# Altium schematic sheet TP_IHM_7SEG.SchDoc
size A4
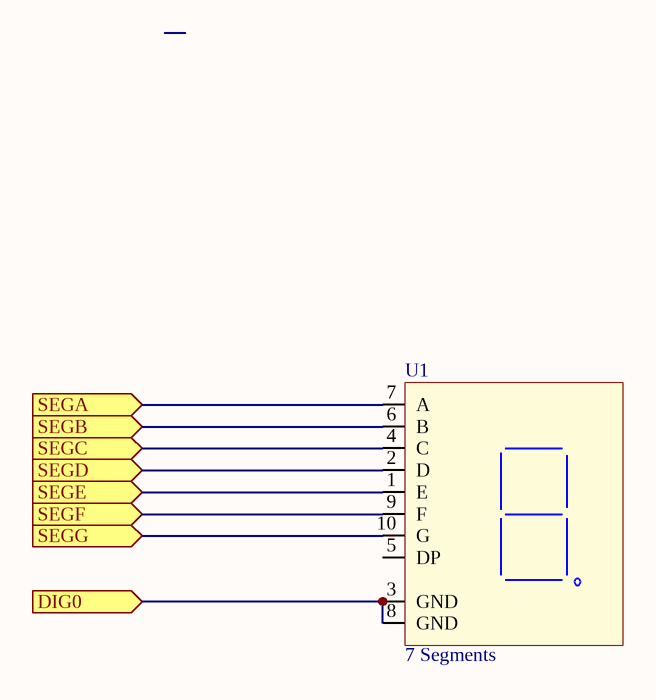
[diagram p0: TP_IHM_7SEG.SchDoc]

## Parts
U1  7 Segments  [SA10-21GWA]

## Ports
DIG0, SEGA, SEGB, SEGC, SEGD, SEGE, SEGF, SEGG

## Nets
DIG0: U1.3(GND) U1.8(GND) ; port DIG0
SEGA: U1.7(A) ; port SEGA
SEGB: U1.6(B) ; port SEGB
SEGC: U1.4(C) ; port SEGC
SEGD: U1.2(D) ; port SEGD
SEGE: U1.1(E) ; port SEGE
SEGF: U1.9(F) ; port SEGF
SEGG: U1.10(G) ; port SEGG

Not connected (* = marked no-connect by the designer): U1 5(DP)

## Library data of the parts
U1 = SC10-21SRWA: KingBright Led 7 Segments; Reference: SC10-21SRWA